# EAGLE design 201_010_010-001_RemoteDAQ (EAGLE 7.6.0)
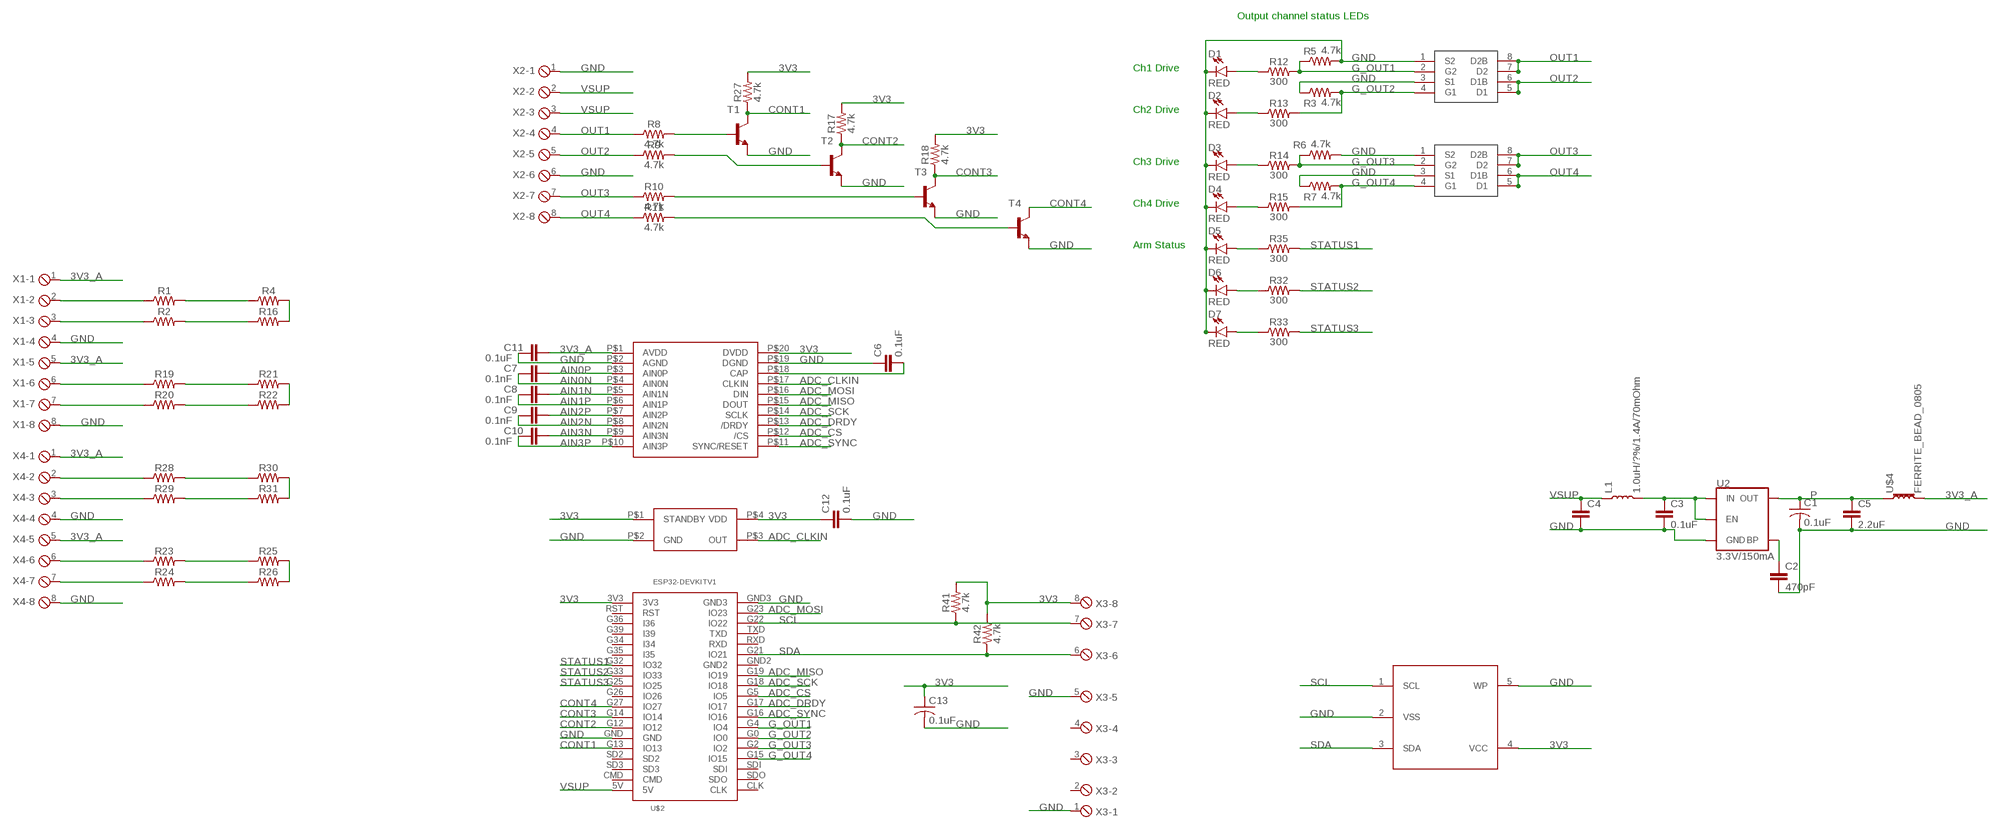
[diagram p0: schematic, sheet 1]

## Parts
C1  0.1uF  C-USC0603K  [C0603K]
C2  470pF  CAP-0603  [0603]
C3  0.1uF  CAP-0603  [0603]
C4  CAP-0603  [0603]
C5  2.2uF  CAP-0805  [0805]
C6  0.1uF  CAP-0603  [0603]
C7  0.1nF  CAP-0603  [0603]
C8  0.1nF  CAP-0603  [0603]
C9  0.1nF  CAP-0603  [0603]
C10  0.1nF  CAP-0603  [0603]
C11  0.1uF  CAP-0603  [0603]
C12  0.1uF  CAP-0603  [0603]
C13  0.1uF  C-USC0603K  [C0603K]
D1  RED  LED-RED0603  [LED-0603]
D2  RED  LED-RED0603  [LED-0603]
D3  RED  LED-RED0603  [LED-0603]
D4  RED  LED-RED0603  [LED-0603]
D5  RED  LED-RED0603  [LED-0603]
D6  RED  LED-RED0603  [LED-0603]
D7  RED  LED-RED0603  [LED-0603]
L1  1.0uH/?%/1.4A/70mOhm  INDUCTOR-0805_WIDE-1.0UH  [0805-WIDE]
R1  RESISTOR0603  [0603]
R2  RESISTOR0603  [0603]
R3  4.7k  4.7KOHM-0603-1/10W-1%  [0603]
R4  RESISTOR0603  [0603]
R5  4.7k  4.7KOHM-0603-1/10W-1%  [0603]
R6  4.7k  4.7KOHM-0603-1/10W-1%  [0603]
R7  4.7k  4.7KOHM-0603-1/10W-1%  [0603]
R8  4.7k  4.7KOHM-0603-1/10W-1%  [0603]
R9  4.7k  4.7KOHM-0603-1/10W-1%  [0603]
R10  4.7k  4.7KOHM-0603-1/10W-1%  [0603]
R11  4.7k  4.7KOHM-0603-1/10W-1%  [0603]
R12  300  300OHM-0603-1/10W-1%  [0603]
R13  300  300OHM-0603-1/10W-1%  [0603]
R14  300  300OHM-0603-1/10W-1%  [0603]
R15  300  300OHM-0603-1/10W-1%  [0603]
R16  RESISTOR0603  [0603]
R17  4.7k  4.7KOHM-0603-1/10W-1%  [0603]
R18  4.7k  4.7KOHM-0603-1/10W-1%  [0603]
R19  RESISTOR0603  [0603]
R20  RESISTOR0603  [0603]
R21  RESISTOR0603  [0603]
R22  RESISTOR0603  [0603]
R23  RESISTOR0603  [0603]
R24  RESISTOR0603  [0603]
R25  RESISTOR0603  [0603]
R26  RESISTOR0603  [0603]
R27  4.7k  4.7KOHM-0603-1/10W-1%  [0603]
R28  RESISTOR0603  [0603]
R29  RESISTOR0603  [0603]
R30  RESISTOR0603  [0603]
R31  RESISTOR0603  [0603]
R32  300  300OHM-0603-1/10W-1%  [0603]
R33  300  300OHM-0603-1/10W-1%  [0603]
R35  300  300OHM-0603-1/10W-1%  [0603]
R41  4.7k  4.7KOHM-0603-1/10W-1%  [0603]
R42  4.7k  4.7KOHM-0603-1/10W-1%  [0603]
T1  BC849-NPN-SOT23-BEC  [SOT23-BEC]
T2  BC849-NPN-SOT23-BEC  [SOT23-BEC]
T3  BC849-NPN-SOT23-BEC  [SOT23-BEC]
T4  BC849-NPN-SOT23-BEC  [SOT23-BEC]
U2  3.3V/150mA  V_REG_MIC52053.3V  [SOT23-5]
U$1  ADS131M04  [TSSOP-20]
U$2  ESP32DEVKITV1  [ESP32-DEVKITV1]
U$3  AO4806  [SO08]
U$4  FERRITE_BEAD_0805  [0805]
U$5  AO4806  [SO08]
U$6  DSC1033  [7X5_PP]
U$7  24AA16T  [SOT23-5L]
X1  MPT8  [8POL254]
X2  MPT8  [8POL254]
X3  MPT8  [8POL254]
X4  MPT8  [8POL254]

## Nets
3V3: C12.1 C13.1 R17.2 R18.2 R27.2 R41.2 R42.2 U$1.P$20(DVDD) U$2.3V3 U$6.P$1(STANDBY) U$6.P$4(VDD) U$7.4(VCC) X3.8
3V3_A: C11.2 U$1.P$1(AVDD) U$4.2 X1.1 X1.5 X4.1 X4.5
ADC_CLKIN: U$1.P$17(CLKIN) U$6.P$3(OUT)
ADC_CS: U$1.P$12(/CS) U$2.G5(IO5)
ADC_DRDY: U$1.P$13(/DRDY) U$2.G17(IO17)
ADC_MISO: U$1.P$15(DOUT) U$2.G19(IO19)
ADC_MOSI: U$1.P$16(DIN) U$2.G23(IO23)
ADC_SCK: U$1.P$14(SCLK) U$2.G18(IO18)
ADC_SYNC: U$1.P$11(SYNC/RESET) U$2.G16(IO16)
AIN0N: C7.1 R2.2 R16.1 U$1.P$4(AIN0N)
AIN0P: C7.2 R1.2 R4.1 U$1.P$3(AIN0P)
AIN1N: C8.2 R20.2 R22.1 U$1.P$5(AIN1N)
AIN1P: C8.1 R19.2 R21.1 U$1.P$6(AIN1P)
AIN2N: C9.1 R24.2 R26.1 U$1.P$8(AIN2N)
AIN2P: C9.2 R23.2 R25.1 U$1.P$7(AIN2P)
AIN3N: C10.2 R29.2 R31.1 U$1.P$9(AIN3N)
AIN3P: C10.1 R28.2 R30.1 U$1.P$10(AIN3P)
CONT1: R27.1 T1.C U$2.G13(IO13)
CONT2: R17.1 T2.C U$2.G12(IO12)
CONT3: R18.1 T3.C U$2.G14(IO14)
CONT4: T4.C U$2.G27(IO27)
G_OUT1: R5.1 R12.2 U$2.G4(IO4) U$3.2(G2)
G_OUT2: R3.2 R13.2 U$2.G0(IO0) U$3.4(G1)
G_OUT3: R6.1 R14.2 U$2.G2(IO2) U$5.2(G2)
G_OUT4: R7.2 R15.2 U$2.G15(IO15) U$5.4(G1)
GND: C1.2 C2.2 C3.2 C4.2 C5.2 C6.1 C11.1 C12.2 C13.2 D1.C D2.C D3.C D4.C D5.C D6.C D7.C R3.1 R5.2 R6.2 R7.1 T1.E T2.E T3.E T4.E U2.2(GND) U$1.P$2(AGND) U$1.P$19(DGND) U$2.GND U$2.GND3 U$3.1(S2) U$3.3(S1) U$5.1(S2) U$5.3(S1) U$6.P$2(GND) U$7.2(VSS) U$7.5(WP) X1.4 X1.8 X2.1 X2.6 X3.1 X3.5 X4.4 X4.8
N$1: C2.1 U2.4(BP)
N$2: C3.1 L1.2 U2.1(IN) U2.3(EN)
N$3: R8.2 T1.B
N$4: R9.2 T2.B
N$6: R1.1 X1.2
N$7: R10.2 T3.B
N$8: R11.2 T4.B
N$9: D1.A R12.1
N$10: D2.A R13.1
N$11: R2.1 X1.3
N$12: R19.1 X1.6
N$13: D3.A R14.1
N$14: D4.A R15.1
N$15: C6.2 U$1.P$18(CAP)
N$17: R20.1 X1.7
N$19: R4.2 R16.2
N$20: R21.2 R22.2
N$21: R28.1 X4.2
N$22: R29.1 X4.3
N$23: R25.2 R26.2
N$24: R23.1 X4.6
N$27: D5.A R35.1
N$29: R24.1 X4.7
N$30: R30.2 R31.2
N$31: D6.A R32.1
N$32: D7.A R33.1
OUT1: R8.1 U$3.7(D2) U$3.8(D2B) X2.4
OUT2: R9.1 U$3.5(D1) U$3.6(D1B) X2.5
OUT3: R10.1 U$5.7(D2) U$5.8(D2B) X2.7
OUT4: R11.1 U$5.5(D1) U$5.6(D1B) X2.8
P: C1.1 C5.1 U2.5(OUT) U$4.1
SCL: R41.1 U$2.G22(IO22) U$7.1(SCL) X3.7
SDA: R42.1 U$2.G21(IO21) U$7.3(SDA) X3.6
STATUS1: R35.2 U$2.G32(IO32)
STATUS2: R32.2 U$2.G33(IO33)
STATUS3: R33.2 U$2.G25(IO25)
VSUP: C4.1 L1.1 U$2.5V X2.2 X2.3
Unconnected: U$2.CLK U$2.CMD U$2.G26(IO26) U$2.G34(I34) U$2.G35(I35) U$2.G36(I36) U$2.G39(I39) U$2.GND2 U$2.RST U$2.RXD U$2.SD2 U$2.SD3 U$2.SDI U$2.SDO U$2.TXD X3.2 X3.3 X3.4

## Notes on the sheet
- Output channel status LEDs
- Ch1 Drive
- Ch2 Drive
- Ch3 Drive
- Ch4 Drive
- Arm Status

## Library data of the parts
C1 C13 = HopeRF:C-US: CAPACITOR, American symbol
C2-C12 = SparkFun-Capacitors:CAP
D1-D7 = SparkFun-LED:LED-RED: Red SMD LED Used in manufacturing of most products at SparkFun Packages: 0603 - SMD 0603 package [Product Link] <http://docs.avagotech.com/docs/AV02-0551EN> 0603 SMART - SMD 0603 SMART package ( more efficient and expensive)[Product Link] <http://www.osram-os.com/Graphics/XPic2/00077099_0.pdf> 1206 - SMD1206 package [Product Link] <https://www.sparkfun.com/datasheets/DevTools/LilyPad/Q150OVS4.pdff> SparkFun Products: Pro Mini 328 -5V <https://www.sparkfun.com/products/821> RedBoard <https://www.sparkfun.com/products/12757> IOIO-OTG <https://www.sparkfun.com/products/13613>; PROD_ID: DIO-00819
L1 = SparkFun-Coils:INDUCTOR: Inductors Resist changes in electrical current. Basically a coil of wire. SparkFun Products: SparkFun Load Cell Amplifier - HX711 <https://www.sparkfun.com/products/13879> IOIO-OTG - V2.2 <https://www.sparkfun.com/products/13613>; PROD_ID: NDUC-14237
R1 R2 R4 R16 R19-R26 R28-R31 = SparkFun-Resistors:RESISTOR: Generic Resistor Package
R3 R5-R11 R17 R18 R27 R41 R42 = SparkFun-Resistors:4.7KOHM: 4.7kΩ resistor A resistor is a passive two-terminal electrical component that implements electrical resistance as a circuit element. Resistors act to reduce current flow, and, at the same time, act to lower voltage levels within circuits. - Wikipedia; PROD_ID: RES-07857
R12-R15 R32 R33 R35 = SparkFun-Resistors:300OHM: 300Ω resistor A resistor is a passive two-terminal electrical component that implements electrical resistance as a circuit element. Resistors act to reduce current flow, and, at the same time, act to lower voltage levels within circuits. - Wikipedia; PROD_ID: RES-10328
T1-T4 = HopeRF:*-NPN-: NPN Transistror BF959 corrected 2008.03.06
U2 = SparkFun-IC-Power:V_REG_MIC5205: V_REG MIC5205 Standard 3.3V, 5V, and Adjustable 150mA LDO voltage regulator in SOT-23 layout. Micrel part MIC5205. BP (by-pass) pin is used to lower output noise with 470pF cap, may be left open. On the adjustable version BP is used to set output.; PROD_ID: VREG-00822
U$1 = texas:ADS131M04
U$2 = ESP32-DEVKIT_Rev1_JT:ESP32DEVKITV1; OC_NEWARK: unknown
U$3 U$5 = cs_fets:AO4806
U$4 = SparkFun-Coils:FERRITE_BEAD_0805
U$6 = micrel:DSC1033
U$7 = HopeRF:24AA16T
X1-X4 = con-phoenix-254:MPT8: PHOENIX CONNECTOR; OC_FARNELL: unknown; OC_NEWARK: unknown

## Module DTMF
Ports: 

### Library data of the parts

## Board
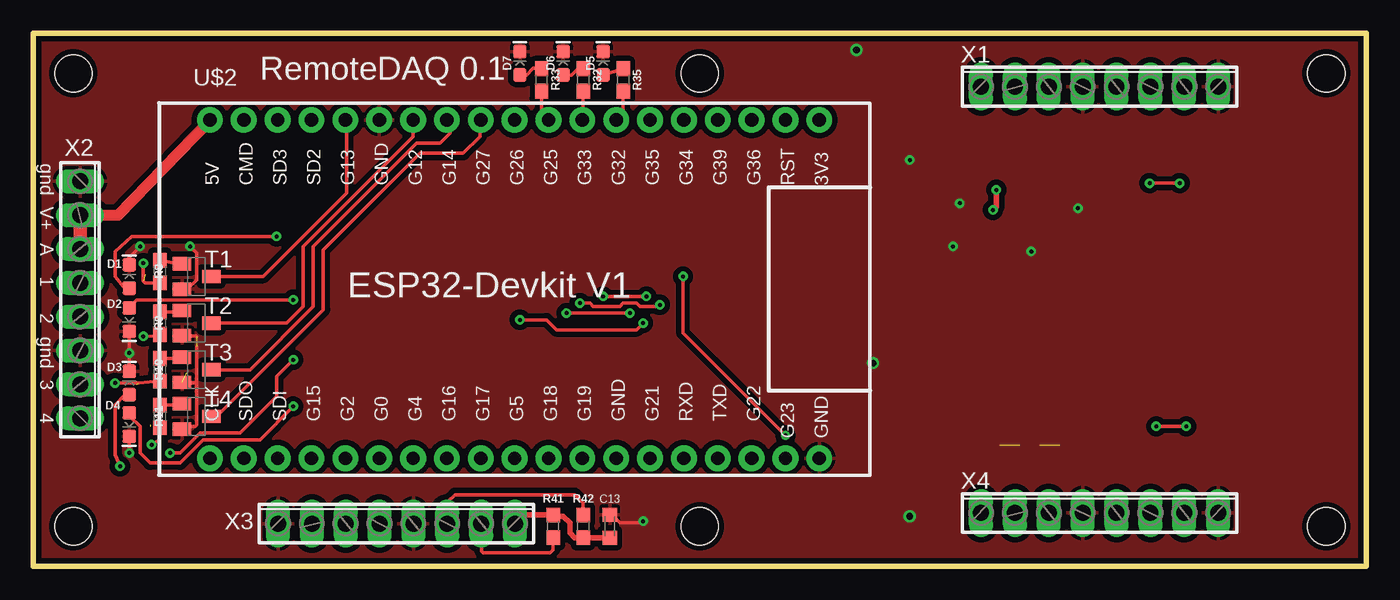
[diagram p1: board, top side]
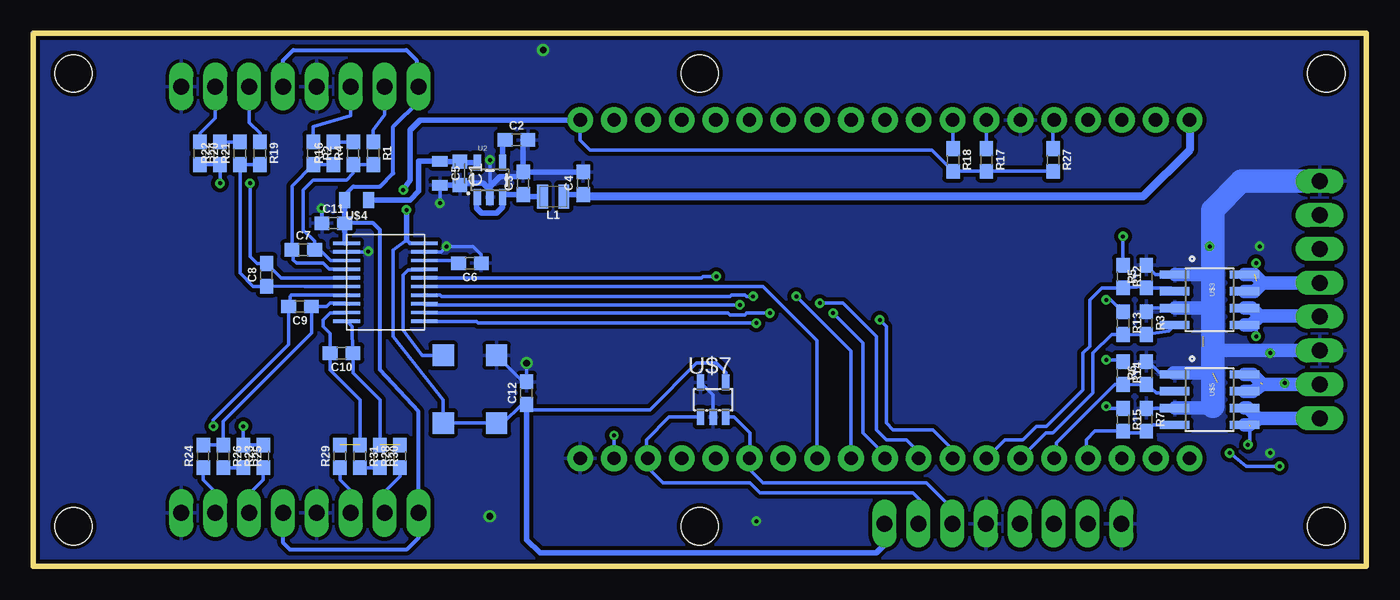
[diagram p2: board, bottom side, seen from below]

Size 100 x 40 mm. Coordinates in mm from the lower left corner, seen from the top.
Outline: 0,40 0,0 100,0 100,40 0,40
Copper layers (1*16): Top 0.035mm / dielectric 1.5mm / Bottom 0.035mm
Design rules "default *": minimum track width 6mil, minimum drill 0.3mm, track to track 6mil, track to pad 6mil, pad to pad 6mil, via to via 6mil, smd to smd 6mil, copper to edge 10mil, drill to drill 8mil, minimum pad ring 10mil, minimum via ring 8mil, stop-mask expansion 4mil, vias tented up to drill 0mil, thermal gap 10mil
Holes 2.8 mm at 3,37 3,3 97,3 97,37 50,37 50,3

### Footprints (pad centres in the part's own frame; a part is rotated, then mirrored left to right if it is on the bottom)
C0603K = smd 1.05 x 1.08: 1 -0.875,0; 2 0.875,0
0603 = smd 1.1 x 1: 1 -0.85,0; 2 0.85,0
0805 = smd 0.8 x 1.2: 1 -0.9,0; 2 0.9,0
LED-0603 = smd 1 x 1: A -0.877,0; C 0.877,0
0805-WIDE = smd 0.8 x 1.8: 1 -0.8,0; 2 0.8,0
SOT23-BEC = smd 1 x 1.4: B -0.95,-1.1; C 0,1.1; E 0.95,-1.1
SOT23-5 = smd 0.55 x 1.2: 1 -0.95,-1.3; 2 0,-1.3; 3 0.95,-1.3; 4 0.95,1.3; 5 -0.95,1.3
TSSOP-20 = smd 2 x 0.25: P$1 0,0; P$2 0,-0.65; P$3 0,-1.3; P$4 0,-1.95; P$5 0,-2.6; P$6 0,-3.25; P$7 0,-3.9; P$8 0,-4.55; P$9 0,-5.2; P$10 0,-5.85; P$11 5.85,-5.85; P$12 5.85,-5.2; P$13 5.85,-4.55; P$14 5.85,-3.9; P$15 5.85,-3.25; P$16 5.85,-2.6; P$17 5.85,-1.95; P$18 5.85,-1.3; P$19 5.85,-0.65; P$20 5.85,0
ESP32-DEVKITV1 = drill 1 pad 1.93: 3V3 0,45.72; 5V 0,0; CLK 25.4,0; CMD 0,2.54; G0 25.4,12.7; G2 25.4,10.16; G4 25.4,15.24; G5 25.4,22.86; G12 0,15.24; G13 0,10.16; G14 0,17.78; G15 25.4,7.62; G16 25.4,17.78; G17 25.4,20.32; G18 25.4,25.4; G19 25.4,27.94; G21 25.4,33.02; G22 25.4,40.64; G23 25.4,43.18; G25 0,25.4; G26 0,22.86; G27 0,20.32; G32 0,30.48; G33 0,27.94; G34 0,35.56; G35 0,33.02; G36 0,40.64; G39 0,38.1; GND 0,12.7; GND2 25.4,30.48; GND3 25.4,45.72; RST 0,43.18; RXD 25.4,35.56; SD2 0,7.62; SD3 0,5.08; SDI 25.4,5.08; SDO 25.4,2.54; TXD 25.4,38.1
SO08 = smd 0.61 x 2.21: 1 -1.905,-2.616; 2 -0.635,-2.616; 3 0.635,-2.616; 4 1.905,-2.616; 5 1.905,2.616; 6 0.635,2.616; 7 -0.635,2.616; 8 -1.905,2.616
7X5_PP = smd 1.6 x 1.6: P$1 0,0; P$2 5.08,0; P$3 5.08,4; P$4 0,4
SOT23-5L = smd 0.55 x 1.2: 1 -0.95,-1.3; 2 0,-1.3; 3 0.95,-1.3; 4 0.95,1.3; 5 -0.95,1.3
8POL254 = drill 1.2 long: 1 -8.89,0; 2 -6.35,0; 3 -3.81,0; 4 -1.27,0; 5 1.27,0; 6 3.81,0; 7 6.35,0; 8 8.89,0

### Placement (x,y rotation side)
C1  68,29.5 270 bottom
C2  63.75,32 0 bottom
C3  63.25,28.75 90 bottom
C4  58.75,28.75 90 bottom
C5  69.5,29.5 270 bottom
C6  67.25,22.75 180 bottom
C7  79.75,23.75 0 bottom
C8  82.5,21.88 90 bottom
C9  80,19.5 180 bottom
C10  76.88,16 180 bottom
C11  77.5,25.75 0 bottom
C12  63,13 90 bottom
C13  43.25,3 90 top
D1  7.2,21.75 90 top
D2  7.2,18.5 270 top
D3  7.2,13.75 90 top
D4  7.2,10.62 270 top
D5  42.75,37.75 90 top
D6  39.75,37.75 90 top
D7  36.5,37.75 90 top
L1  61,27.75 180 bottom
R1  74.5,31 270 bottom
R2  79,31 270 bottom
R3  16.5,18.25 270 bottom
R4  76,31 90 bottom
R5  16.5,21.75 90 bottom
R6  16.5,14.5 90 bottom
R7  16.5,11 270 bottom
R8  9.5,22.12 90 top
R9  9.5,18.25 90 top
R10  9.5,14.75 90 top
R11  9.5,11.25 90 top
R12  18.25,21.75 270 bottom
R13  18.25,18.25 270 bottom
R14  18.25,14.5 270 bottom
R15  18.25,11 270 bottom
R16  77.5,31 90 bottom
R17  28.5,30.5 270 bottom
R18  31,30.5 270 bottom
R19  83,31 270 bottom
R20  87.5,31 270 bottom
R21  84.5,31 90 bottom
R22  86,31 90 bottom
R23  82.75,8.25 90 bottom
R24  87.25,8.25 90 bottom
R25  84.25,8.25 270 bottom
R26  85.75,8.25 270 bottom
R27  23.5,30.5 270 bottom
R28  72.5,8.25 90 bottom
R29  77,8.25 90 bottom
R30  74,8.25 270 bottom
R31  75.5,8.25 270 bottom
R32  41.25,36.5 270 top
R33  38.12,36.5 270 top
R35  44.25,36.5 270 top
R41  39,3 90 top
R42  41.25,3 270 top
T1  12.25,21.75 270 top
T2  12.25,18.25 270 top
T3  12.25,14.75 270 top
T4  12.25,11.25 270 top
U2  65.75,29 0 bottom
U$1  76.5,24.25 0 bottom
U$2  13.25,33.5 270 top
U$3  11.75,20 270 bottom
U$4  75.75,27.5 180 bottom
U$5  11.75,12.5 270 bottom
U$6  65.25,10.75 90 bottom
U$7  49,12.5 0 bottom
X1  80,36 0 top
X2  3.5,20 270 top
X3  27.25,3.2 0 top
X4  80,4 0 top

### Tracks (layer width: path | path; a pad name or v marks a point on that pad's centre or on a via)
3V3  (via drill 0.3)
  Top 0.406: v72.25,28.25 72.25,27 v72,26.75 | X3.8 36.79,3.85 R41.2 39.1,3.75 39.75,3.75 40.25,3.25 40.25,2.5 40.6,2.15 R42.2 41.27,2.12 C13.1
  Bottom 0.254: R27.2 R17.2 R18.2 32.6,31.25 58.25,31.25 58.97,31.97 U$2.3V3 | 72,24.5 73,23.75 73,17.25 69.25,12.5 U$6.P$4 U$6.P$1 64.75,10.75 63.35,12.15 C12.1 62.6,11.75 53.75,11.75 50.25,15.25 48.75,15.25 48.05,14.55 U$7.4
  Bottom 0.305: 72,24.5 71.75,24.25 U$1.P$20
  Bottom 0.406: U$2.3V3 71,33.5 71.75,32.75 71.75,29 v72.25,28.25 | v72,26.75 72,24.5 | C12.1 63,2 62,1 36.75,1 36,1.75 36,3.06 X3.8
3V3_A
  Bottom 0.305: U$4.2 76.65,27.85 76,28.5 74,28.5 73,29.5 73,33 71,35 71,35.89 X1.1 71.25,36.14 71.25,38 72,38.75 80.5,38.75 81.27,37.98 X1.5 | C11.2 74.5,25.75 74,25.25 74,14.75 71.11,11.61 X4.1 71.11,2.14 72,1.25 80.75,1.25 81.25,1.75 81.25,3.98 X4.5
  Bottom 0.406: U$1.P$1 76.6,24.25 C11.2 U$4.2
ADC_CLKIN
  Bottom 0.254: U$6.P$3 70.83,15.83 72.25,17.75 72.25,21.88 71.88,22.25 70.7,22.25 U$1.P$17
ADC_CS  (via drill 0.3)
  Top 0.254: v40,19 v44.75,19
  Bottom 0.254: U$2.G5 36.11,8.36 37.75,10 37.75,16.75 v40,19 | v44.75,19 46.5,19 46.62,18.88 47.75,18.88 47.88,19 70.6,19 U$1.P$12
ADC_DRDY  (via drill 0.3)
  Top 0.254: v47,19.62 46.88,19.5 45.5,19.5 45.25,19.75 44.25,19.75 44,19.5 42,19.5 41.75,19.75 v41,19.75
  Bottom 0.254: U$2.G17 33.57,8.57 34.5,9.5 36,9.5 36.75,10.25 36.75,17.25 39.25,19.75 v41,19.75 | v47,19.62 70.58,19.62 U$1.P$13
ADC_MISO
  Bottom 0.254: U$2.G19 41.19,16.94 45.25,21 U$1.P$15
ADC_MOSI  (via drill 0.3)
  Top 0.254: v48.75,21.75 48.75,17.5 v56.43,9.82
  Bottom 0.254: U$2.G23 v56.43,9.82 | v48.75,21.75 49.75,21.75 49.88,21.62 70.62,21.62 U$1.P$16
ADC_SCK  (via drill 0.3)
  Top 0.254: v42.75,20.25 v46,20.25
  Bottom 0.254: U$2.G18 38.65,16.15 v42.75,20.25 | U$1.P$14 70.62,20.38 69.5,20.38 69.38,20.25 47.75,20.25 47.62,20.38 46.62,20.38 46.5,20.25 v46,20.25
ADC_SYNC  (via drill 0.3)
  Top 0.254: v36.5,18.5 38.5,18.5 39.25,17.75 45.25,17.75 v45.75,18.25
  Bottom 0.254: U$2.G16 31.03,8.78 32.5,10.25 35.5,10.25 36,10.75 36,18 v36.5,18.5 | v45.75,18.25 66.62,18.25 66.75,18.38 70.62,18.38 U$1.P$11
AIN0N
  Bottom 0.254: U$1.P$4 77.8,22.3 78.25,22.75 80.25,22.75 80.5,23 80.5,23.65 C7.1 80.6,28.55 R2.2 R16.1
AIN0P
  Bottom 0.254: R1.2 R4.1 76,29.5 76.5,29 79,29 79.75,28.25 79.75,25.25 78.9,24.4 C7.2 78.5,23.75 77.7,22.95 U$1.P$3
AIN1N  (via drill 0.3)
  Top 0.254: v83.75,28.75 v86,28.75
  Bottom 0.254: U$1.P$5 81.42,21.65 C8.2 83.22,22.73 83.75,23.25 v83.75,28.75 | R20.2 R22.1 v86,28.75
AIN1P
  Bottom 0.254: U$1.P$6 79.65,21 C8.1 82.53,21 83.5,21 84.5,22 R21.1 R19.2
AIN2N
  Bottom 0.254: U$1.P$8 76.55,19.75 77.75,19.75 78,19.5 C9.1 79.12,19.48 79.12,17.5 85.75,10.88 R26.1 R24.2
AIN2P  (via drill 0.3)
  Top 0.254: v86.5,10.5 v84.25,10.5
  Bottom 0.254: U$1.P$7 80.65,20.35 80.75,20.25 80.75,19.6 C9.2 80.85,16.65 86.5,11 v86.5,10.5 | R23.2 R25.1 v84.25,10.5
AIN3N  (1 unrouted)
  Bottom 0.254: R31.1 75.5,12.5 77.75,14.75 77.75,15.97 C10.2 77.72,17.48 78.25,18 78.25,18.5 77.75,19 76.55,19 U$1.P$9
AIN3P  (1 unrouted)
  Bottom 0.254: R30.1 74,12.5 76,14.5 76,15.9 C10.1 76.1,18 U$1.P$10
CONT1
  Top 0.254: T1.C 17.25,21.75 23.5,28 23.5,33.41 U$2.G13
  Bottom 0.254: R27.1 23.5,33.41 U$2.G13
CONT2
  Top 0.254: T2.C 19,18.25 20.25,19.5 20.25,24 28.5,32.25 U$2.G12
  Bottom 0.254: 28.28,30.88 R17.1 U$2.G12
CONT3
  Top 0.254: T3.C 16.25,14.75 21,19.5 21,24 28.75,31.75 30.5,31.75 31.25,32.5 31.25,33.28 U$2.G14
  Bottom 0.254: R18.1 31,33.47 U$2.G14
CONT4
  Top 0.254: T4.C 13.75,11.25 21.75,19.25 21.75,23.75 29,31 32.25,31 33.5,32.25 33.5,33.43 U$2.G27
G_OUT1
  Bottom 0.254: U$3.2 14.63,20.9 R5.1 16.6,21 R12.2 19.85,20.9 20.75,20 20.75,16.5 21.25,16 21.25,13.25 24,10.5 24.75,10.5 25.75,9.5 27.09,9.5 U$2.G4
G_OUT2
  Bottom 0.254: U$3.4 14.81,17.65 R3.2 16.6,17.38 R13.2 19.1,17.4 20.5,16 20.5,13 23.5,10 24.05,10 U$2.G0
G_OUT3
  Bottom 0.254: U$5.2 14.5,13 15.75,13 16.15,13.4 R6.1 16.73,13.62 R14.2 18.85,13.65 23.25,9.25 23.25,8.26 U$2.G2
G_OUT4
  Bottom 0.254: U$5.4 16.05,10.6 R7.2 16.6,10 18.1,10 R15.2 20.35,10.15 21,9.5 21,8.23 U$2.G15
GND  (via drill 0.3, 0.3 pad 0.61, 0.5)  (2 unrouted)
  Top 0.254: T4.E 11.35,10.5 12.12,10.5 12.25,10.62 12.25,13.75 | T2.E 12.2,17.3 12.25,17.25 | T3.E 11.2,13.75 12.25,13.75 | 12.25,16.5 12.25,13.75 | T1.E 11.55,20.8 12.25,21.5 12.25,23.5 v11.75,24 | D3.C v7.2,16 D2.C | D4.C v7.2,8.5 | v8,24 7,23 D1.C | C13.2 43.38,3.88 44,3.25 45.62,3.25 v45.75,3.38
  Bottom 0.254: U$5.3 14.38,11.85 R7.1 | R6.2 16.1,15.1 15.5,14.5 14.46,14.5 U$5.1 | U$3.3 16.48,19.36 R3.1 | U$3.1 15.8,21.91 R5.2 | U$1.P$19 69.4,23.6 v69,24 67,24 66.4,23.4 C6.1 | C5.2 v69.5,27.25 | U2.2 v65.75,30.5 | U$1.P$2 75.15,23.6 v74.88,23.62 | U$6.P$2 63.27,13.85 C12.2 v63,15.25 | U$7.2 49,12.85 U$7.5
  Bottom 0.305: C11.1 78.35,26.85 v78.38,26.88
  Bottom 0.406: U2.2 65.75,28.25 | 65.75,28.25 66.25,28.75 67.88,28.75 C1.2 69.47,28.62 C5.2 | C3.2 63.25,31.65 C2.2 | 65.75,28.25 65.75,28.5 65,29.25 63.6,29.25 C3.2 | C3.2 C4.2
  Bottom 1.016: X2.6 11.44,16.19 | U$3.1 11.65,21.91 11.5,21.75 | U$3.3 11.63,19.36 11.5,19.5 | 14.46,14.5 11.5,14.5 | U$5.3 11.62,11.87 11.5,11.75 11.5,12
  Bottom 1.778: X2.1 9.36,28.89 11.5,26.75 11.5,21.75 11.5,19.5 11.5,16.25 | 11.5,16.25 11.5,14.5 11.5,12 | 11.44,16.19 11.5,16.25
  other vias: 65.75,3.75 61.75,38.75
  pour Top (isolate 0.406): 0,40 100,40 100,0 0,0
  pour Bottom (isolate 0.305): 0,40 100,40 100,0 0,0
N$1
  Bottom 0.406: U2.4 64.8,31.8 C2.1
N$2
  Bottom 0.406: L1.2 63.25,27.75 C3.1 64.8,27.9 U2.3 64.8,26.95 65.25,26.5 66.38,26.5 66.75,26.88 66.75,27.65 U2.1
N$3
  Top 0.254: R8.2 11.15,22.6 T1.B
N$4
  Top 0.254: R9.2 11.15,19.1 T2.B
N$6
  Bottom 0.254: X1.2 73.65,33.9 74.5,32.75 R1.1
N$7
  Top 0.254: R10.2 11.15,15.6 T3.B
N$8
  Top 0.254: R11.2 11.15,12.1 T4.B
N$9  (via drill 0.3 pad 0.61)
  Top 0.254: v18.25,24.75 7.38,24.75 6.12,23.62 6.12,21.75 6.75,21 6.87,21 D1.A
  Bottom 0.254: v18.25,24.75 R12.1
N$10  (via drill 0.3 pad 0.61)
  Top 0.254: v19.5,20 7.75,20 D2.A
  Bottom 0.254: v19.5,20 19.15,20 R13.1
N$11
  Bottom 0.254: X1.3 76.19,33.81 79,33 R2.1
N$12
  Bottom 0.254: X1.6 83.81,33.31 83,32.5 R19.1
N$13  (via drill 0.3, 0.3 pad 0.61)
  Top 0.254: v19.5,15.5 18.25,14.25 18.25,12.75 15.5,10 12.5,10 11,8.5 v10.25,8.5 | v6.5,7.5 6.12,8.38 6.12,12.12 6.87,12.87 D3.A
  Bottom 0.254: v19.5,15.5 18.4,15.5 R14.1 | v10.25,8.5 9,7.5 v6.5,7.5
N$14  (via drill 0.3 pad 0.61)
  Top 0.254: 7,11.25 D4.A 7.25,11.25 8,10.5 8,8.5 8.75,7.75 11,7.75 12.75,9.5 17,9.5 v19.5,12
  Bottom 0.254: v19.5,12 19.5,11.85 R15.1
N$15
  Bottom 0.254: U$1.P$18 68.3,22.95 C6.2
N$17
  Bottom 0.254: X1.7 86.35,33.65 87.5,32.5 R20.1
N$19
  Bottom 0.254: R16.2 R4.2
N$20
  Bottom 0.254: R22.2 R21.2
N$21
  Bottom 0.254: X4.2 73.65,5.6 72.5,6.75 R28.1
N$22
  Bottom 0.254: X4.3 76.19,5.69 77,6.5 R29.1
N$23
  Bottom 0.254: R26.2 R25.2
N$24
  Bottom 0.254: X4.6 83.81,5.44 82.75,6.5 R23.1
N$27
  Top 0.254: R35.1 D5.A
N$29
  Bottom 0.254: X4.7 86.35,5.6 87.25,6.5 R24.1
N$30
  Bottom 0.254: R31.2 R30.2
N$31
  Top 0.254: D6.A 40.37,36.87 40.75,37.25 41.15,37.25 R32.1
N$32
  Top 0.254: D7.A 37,36.87 37.5,37.38 38.1,37.38 R33.1
OUT1  (via drill 0.3)  (1 unrouted)
  Top 0.254: R8.1 8.38,21.27 8.25,21.4 v8.25,22.75
  Bottom 1.016: U$3.7 8.38,20.64 7.75,21.27 | 7.75,21.27 X2.4 | U$3.8 8.38,21.91 7.75,21.27
OUT2  (via drill 0.3)
  Top 0.254: R9.1 9.35,17.27 v8.25,17.25
  Bottom 0.254: U$3.5 8.25,18.09 v8.25,17.25
  Bottom 1.016: U$3.5 8.64,18.09 7.96,18.77 | 7.96,18.77 8,18.77 8.59,19.36 U$3.6 | 7.96,18.77 5.04,18.77 X2.5
OUT3  (via drill 0.3)  (1 unrouted)
  Top 0.254: R10.1 7.9,13.78 v6.12,13.75
  Bottom 0.254: 8.51,14.4 8.5,14.15
  Bottom 1.016: U$5.7 8.52,13.13 7.75,13.65 | 7.75,13.65 X2.7 | U$5.8 8.51,14.4 7.75,13.65
OUT4  (via drill 0.3)  (1 unrouted)
  Top 0.254: R11.1 9.47,9.53 v8.88,9.12
  Bottom 0.254: 8.75,10.5 8.75,9.25 v8.88,9.12
  Bottom 1.016: U$5.5 8.76,10.6 8.05,11.05 | 8.05,11.05 8,11.11 5,11.11 X2.8 | U$5.6 8.87,11.87 8.05,11.05
P
  Bottom 0.406: U2.5 67.92,30.3 C1.1 69.47,30.38 C5.1 71.1,30.4 71.1,28.15 71.75,27.5 U$4.1
SCL
  Top 0.254: R41.1 39,1.25 38.75,1 33.75,1 33.62,1.12 33.62,3.17 X3.7
  Bottom 0.254: X3.7 33.5,3.3 33.5,5 34,5.5 45.5,5.5 46.25,6.25 52.75,6.25 53.89,7.39 U$2.G22 54,8.21 54,9.5 52.3,11.2 U$7.1
SDA
  Top 0.254: R42.1 41.25,4.75 40.62,5.38 31.62,5.38 31.12,4.88 31.12,3.27 X3.6
  Bottom 0.254: X3.6 31.25,3.39 31.25,4.5 33,6.25 45.25,6.25 46.27,7.27 U$2.G21 46.25,8.12 46.25,10 47.45,11.2 U$7.3
STATUS1
  Top 0.254: R35.2 44.25,34.02 U$2.G32
STATUS2
  Top 0.254: R32.2 41.25,33.56 U$2.G33
STATUS3
  Top 0.254: R33.2 38.12,34.02 U$2.G25
VSUP
  Top 0.813: X2.2 6.35,26.35 U$2.5V
  Top 1.016: X2.3 X2.2
  Bottom 0.406: C4.1 60.2,27.9 L1.1
  Bottom 0.61: U$2.5V 13.25,31.25 16.75,27.75 58.6,27.75 C4.1

### Text on the board
tNames: RemoteDAQ 0.1 | gnd | V+ | A | 1 | 2 | gnd | 3 | 4